# EAGLE design Beechat_Crank_v1.2_B (EAGLE 9.5.2)

## Sheet 1 of 2
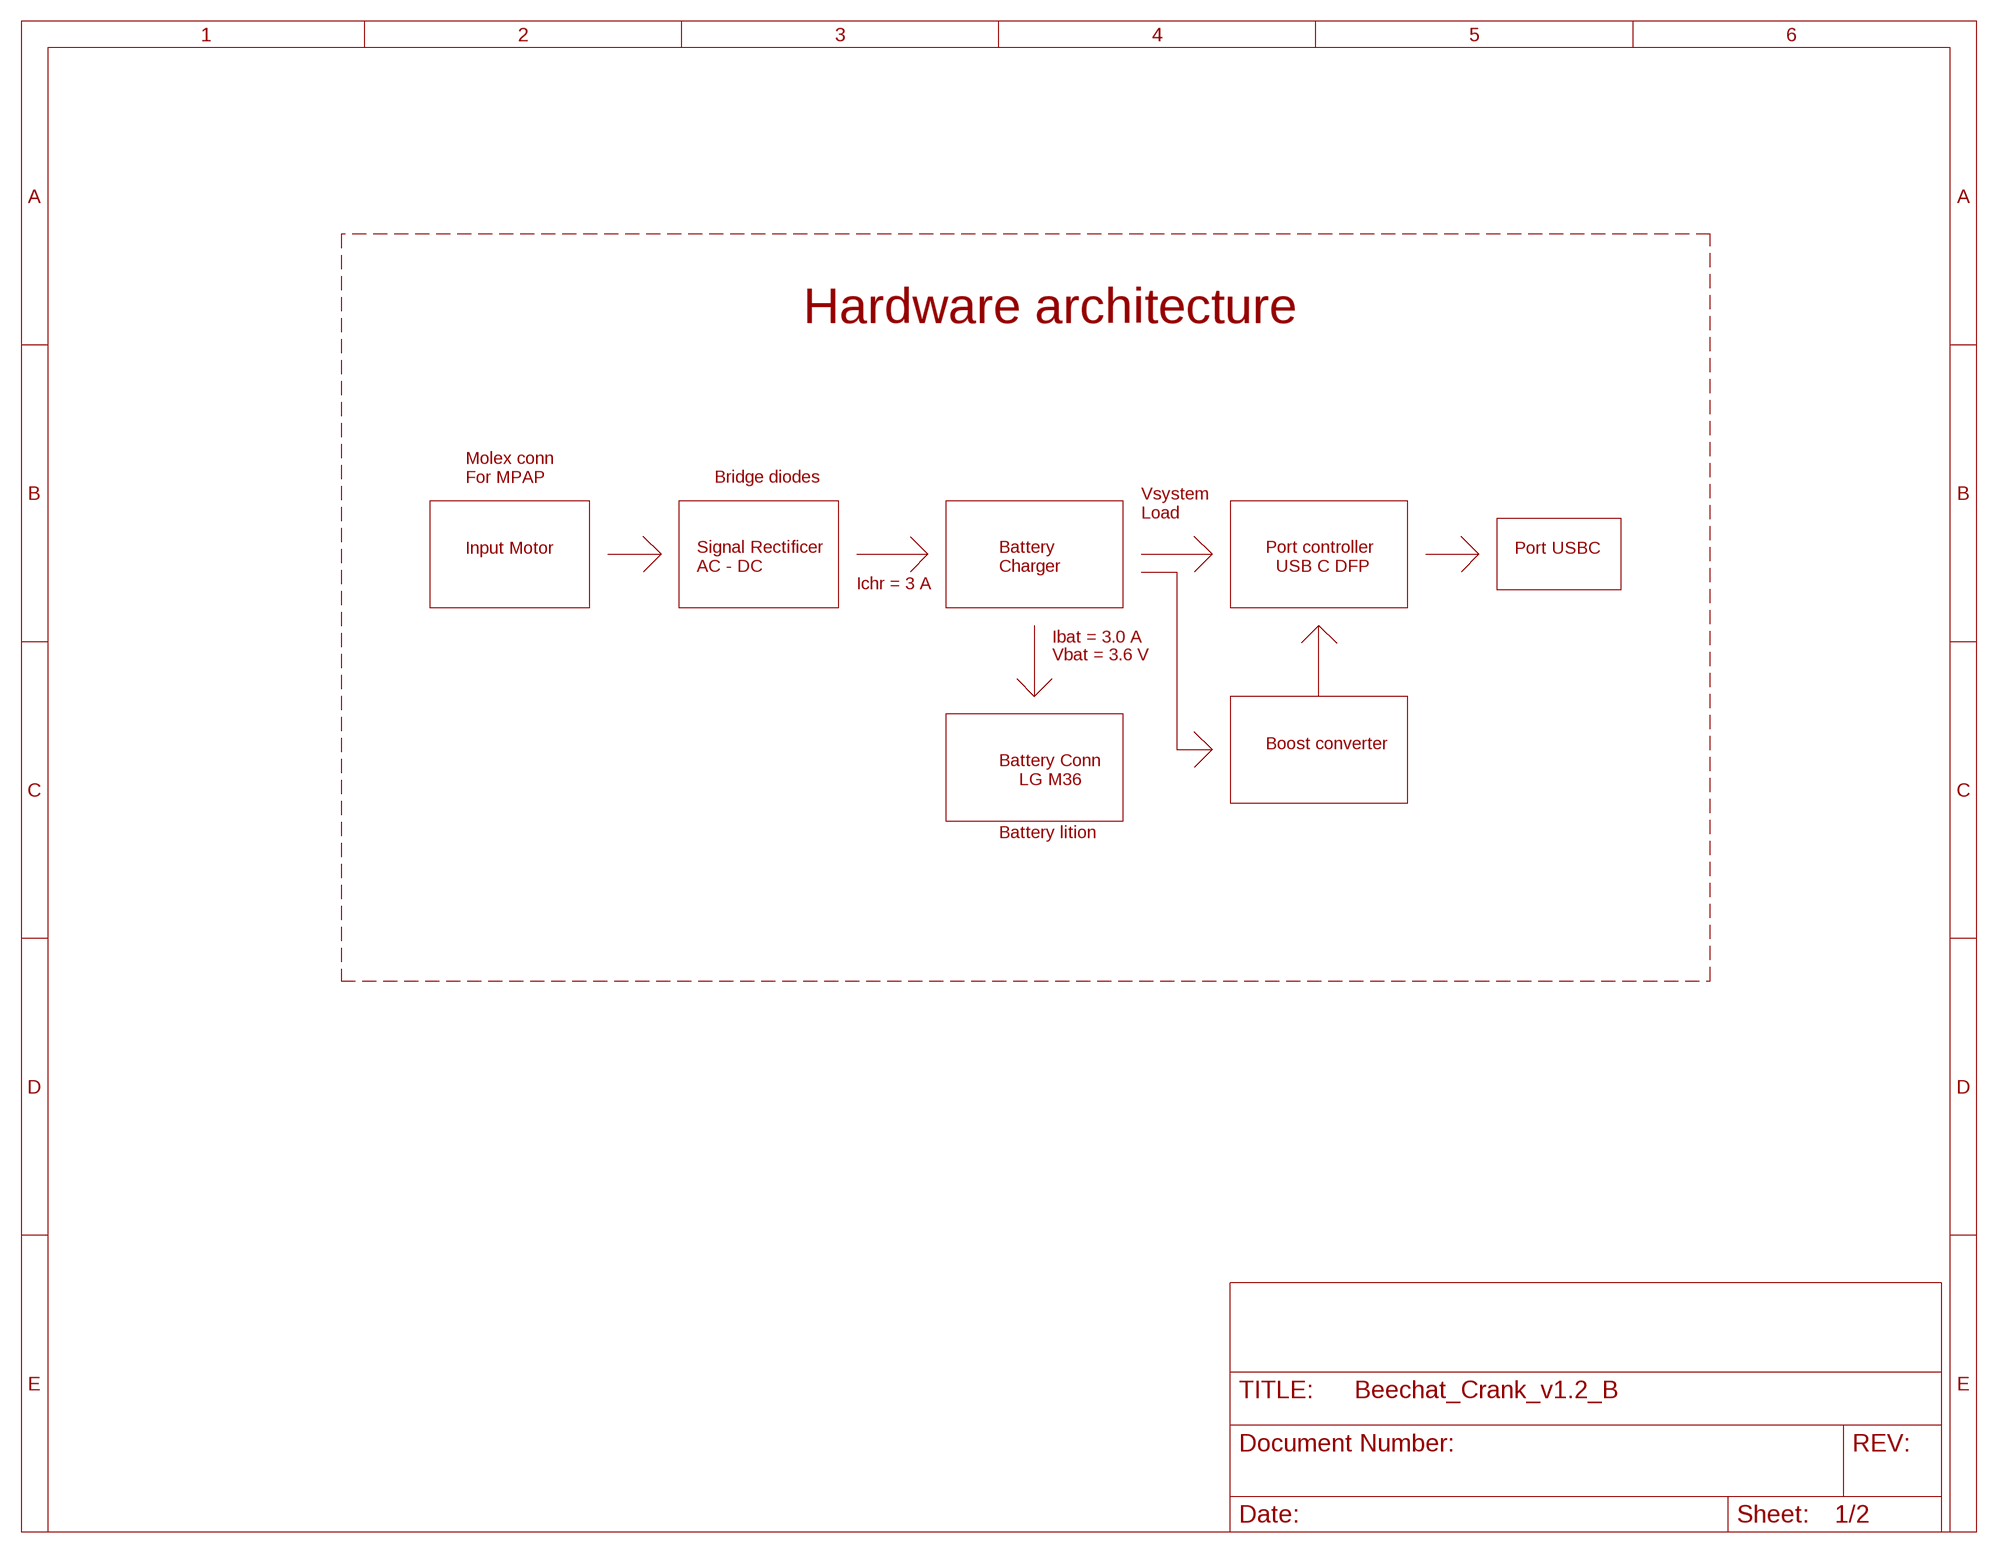
[diagram p0: schematic, sheet 1]

### Notes on the sheet
- Hardware architecture
- Molex conn
  For MPAP
- Bridge diodes
- Vsystem
  Load
- Input Motor | Port USBC
- Signal Rectificer
  AC - DC
- Battery
  Charger
- Port controller
    USB C DFP
- Ichr = 3 A
- Ibat = 3.0 A
- Vbat = 3.6 V
- Boost converter
- Battery Conn
      LG M36
- Battery lition

## Sheet 2 of 2
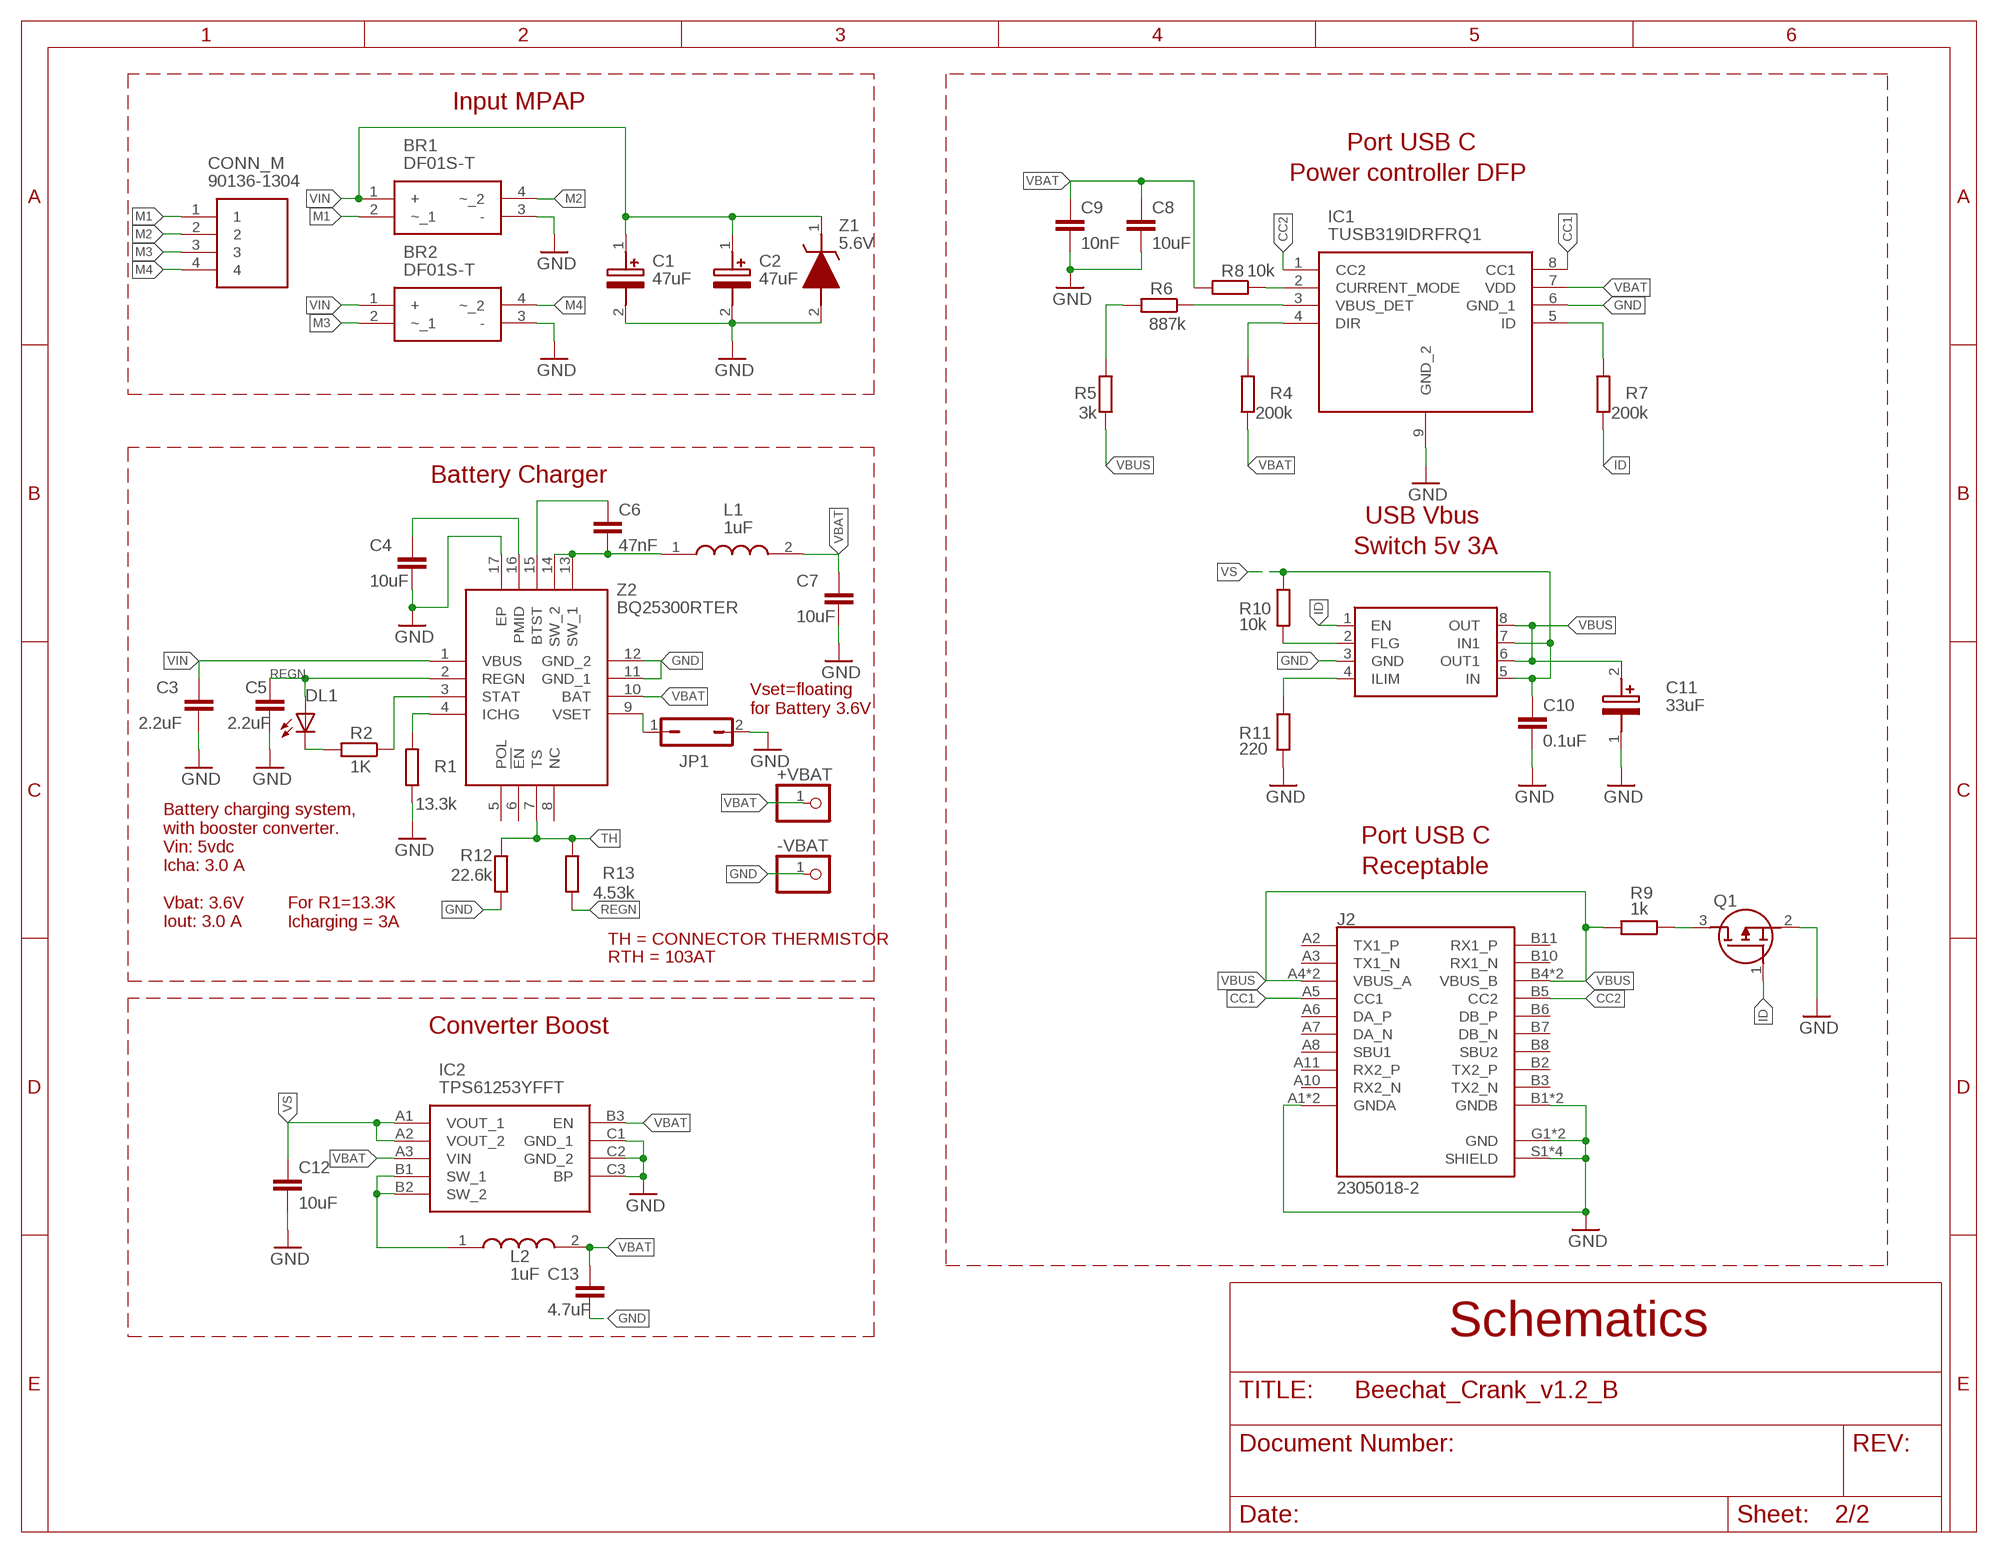
[diagram p1: schematic, sheet 2]

### Parts
+VBAT  PINHD-1X1  [1X01]
-VBAT  PINHD-1X1  [1X01]
BR1  DF01S-T  [SOP510P1040X293-4N]
BR2  DF01S-T  [SOP510P1040X293-4N]
C1  47uF  EEE-HDV470XAP  [CAPAE660X800N]
C2  47uF  EEE-HDV470XAP  [CAPAE660X800N]
C3  2.2uF  C-EUC0603  [C0603]
C4  10uF  C-EUC1210  [C1210]
C5  2.2uF  C-EUC0603  [C0603]
C6  47nF  C-EUC0603  [C0603]
C7  10uF  C-EUC1210  [C1210]
C8  10uF  C-EUC0603  [C0603]
C9  10nF  C-EUC0603  [C0603]
C10  0.1uF  C-EUC0603  [C0603]
C11  33uF  865230343003  [CAPAE660X550N]
C12  10uF  C-EUC0603  [C0603]
C13  4.7uF  C-EUC0603  [C0603]
CONN_M  90136-1304  [SHDR4W65P0X254_1X4_1351X721X11]
DL1  LED_BLUE  LEDSMD0603  [CHIP-LED0603]
IC1  TUSB319IDRFRQ1  [SON50P200X200X80-9N]
IC2  TPS61253YFFT  [BGA9C40P3X3_121X131X62]
J2  2305018-2  [TE_2305018-2]
JP1  JP1Q  [JP1]
L1  1uF  LQH5BPB1R0NT0L  [LQH5BPB100MT0L]
L2  1uF  LQH5BPB1R0NT0L  [LQH5BPB100MT0L]
Q1  SI2337DS-T1-BE3  [SOT95P237X112-3N]
R1  13.3k  R_0603  [R0603]
R2  1K  R_0603  [R0603]
R4  200k  R_0603  [R0603]
R5  3k  R_0603  [R0603]
R6  887k  R_0603  [R0603]
R7  200k  R_0603  [R0603]
R8  10k  R_0603  [R0603]
R9  1k  R_0603  [R0603]
R10  10k  R_0603  [R0603]
R11  220  R_0603  [R0603]
R12  22.6k  R_0603  [R0603]
R13  4.53k  R_0603  [R0603]
U$1  MIC2545  [SOIC127P599X173-8N]
Z1  5.6V  MMSZ5V6T3G  [SOD3716X135N]
Z2  BQ25300RTER  [QFN50P300X300X80-17N]

### Nets
CC1: IC1.8(CC1) J2.A5(CC1)
CC2: IC1.1(CC2) J2.B5(CC2)
GND: -VBAT.1 BR1.3(-) BR2.3(-) C1.2(-) C2.2(-) C3.2 C4.2 C5.2 C7.2 C8.2 C9.2 C10.2 C11.1(-) C12.2 C13.2 IC1.6(GND_1) IC1.9(GND_2) IC2.C1(GND_1) IC2.C2(GND_2) IC2.C3(BP) J2.A1(GNDA) J2.A12(GNDA) J2.B1(GNDB) J2.B12(GNDB) J2.G1(GND) J2.G2(GND) J2.S1(SHIELD) J2.S2(SHIELD) J2.S3(SHIELD) J2.S4(SHIELD) JP1.2 Q1.2(S) R1.1 R11.2 R12.1 U$1.3(GND) Z1.2(A) Z2.11(GND_1) Z2.12(GND_2) Z2.17(EP)
ID: Q1.1(G) R7.1 U$1.1(EN)
M1: BR1.2(~_1) CONN_M.1
M2: BR1.4(~_2) CONN_M.2
M3: BR2.2(~_1) CONN_M.3
M4: BR2.4(~_2) CONN_M.4
N$1: JP1.1 Z2.9(VSET)
N$2: R1.2 Z2.4(ICHG)
N$3: DL1.C R2.2
N$4: C4.1 Z2.16(PMID)
N$5: R2.1 Z2.3(STAT)
N$6: C6.1 Z2.15(BTST)
N$7: C6.2 L1.1 Z2.13(SW_1) Z2.14(SW_2)
N$8: IC1.3(VBUS_DET) R6.1
N$10: R5.2 R6.2
N$11: IC1.4(DIR) R4.2
N$12: IC1.5(ID) R7.2
N$14: R10.2 U$1.2(FLG)
N$15: IC1.2(CURRENT_MODE) R8.1
N$16: IC2.B1(SW_1) IC2.B2(SW_2) L2.1
N$19: Q1.3(D) R9.1
N$20: R11.1 U$1.4(ILIM)
REGN: C5.1 DL1.A R13.1 Z2.2(REGN)
TH: R12.2 R13.2 Z2.7(TS)
VBAT: +VBAT.1 C7.1 C8.1 C9.1 C13.1 IC1.7(VDD) IC2.A3(VIN) IC2.B3(EN) L1.2 L2.2 R4.1 R8.2 Z2.10(BAT)
VBUS: C11.2(+) J2.A4(VBUS_A) J2.A9(VBUS_A) J2.B4(VBUS_B) J2.B9(VBUS_B) R5.1 R9.2 U$1.6(OUT1) U$1.8(OUT)
VIN: BR1.1(+) BR2.1(+) C1.1(+) C2.1(+) C3.1 Z1.1(K) Z2.1(VBUS)
VS: C10.1 C12.1 IC2.A1(VOUT_1) IC2.A2(VOUT_2) R10.1 U$1.5(IN) U$1.7(IN1)
Unconnected: J2.A2(TX1_P) J2.A3(TX1_N) J2.A6(DA_P) J2.A7(DA_N) J2.A8(SBU1) J2.A10(RX2_N) J2.A11(RX2_P) J2.B2(TX2_P) J2.B3(TX2_N) J2.B6(DB_P) J2.B7(DB_N) J2.B8(SBU2) J2.B10(RX1_N) J2.B11(RX1_P) Z2.5(POL) Z2.6(!EN) Z2.8(NC)

### Notes on the sheet
- Input MPAP
- Port USB C
  Power controller DFP
- Battery Charger
- USB Vbus 
  Switch 5v 3A
- Vset=floating 
  for Battery 3.6V
- Port USB C
  Receptable
- Battery charging system, 
  with booster converter.
  Vin: 5vdc
  Icha: 3.0 A
  
  Vbat: 3.6V
  Iout: 3.0 A
- For R1=13.3K
  Icharging = 3A
- TH = CONNECTOR THERMISTOR
- RTH = 103AT
- Converter Boost
- Schematics

## Library data of the parts
+VBAT -VBAT = pinhead:PINHD-1X1: PIN HEADER
BR1 BR2 = Beechat_crank:DF01S-T: 100V 1.0A SURFACE MOUNT GLASS PASSIVATED BRIDGE RECTIFIER Source: Datasheet <https://www.diodes.com/assets/Datasheets/ds17001.pdf>; DESCRIPTION: 100V 1.0A SURFACE MOUNT GLASS PASSIVATED BRIDGE RECTIFIER; HEIGHT: 2.93mm; MANUFACTURER_NAME: Diodes Inc.; MANUFACTURER_PART_NUMBER: DF01S-T; MOUSER_PART_NUMBER: 621-DF01ST; MOUSER_PRICE-STOCK: https://www.mouser.co.uk/ProductDetail/Diodes-Incorporated/DF01S-T?qs=rNZh4F5RthTBu7LNdQlINg%3D%3D
C1 C2 = Beechat_crank:EEE-HDV470XAP: Panasonic 47uF 35V dc Aluminium Electrolytic Capacitor, Surface Mount 6.3 x 7.7mm +105C 6.3mm 7.7mm Source: Datasheet <https://componentsearchengine.com/Datasheets/1/EEE-HDV470XAP.pdf>; DESCRIPTION: Panasonic 47uF 35V dc Aluminium Electrolytic Capacitor, Surface Mount 6.3 x 7.7mm +105C 6.3mm 7.7mm; HEIGHT: 8mm; MANUFACTURER_NAME: Panasonic; MANUFACTURER_PART_NUMBER: EEE-HDV470XAP; MOUSER_PART_NUMBER: 667-EEE-HDV470XAP; MOUSER_PRICE-STOCK: https://www.mouser.com/Search/Refine.aspx?Keyword=667-EEE-HDV470XAP
C3-C10 C12 C13 = rcl:C-EU: CAPACITOR, European symbol; SPICEPREFIX: C
C11 = Beechat_crank:865230343003: Wurth Elektronik Aluminium Electrolytic Capacitor 33uF 16V dc 5.5mm V-Chip WCAP-AS5H Series Aluminium, Surface Mount Source: Datasheet <http://katalog.we-online.com/pbs/datasheet/865230343003.pdf>; DESCRIPTION: Wurth Elektronik Aluminium Electrolytic Capacitor 33uF 16V dc 5.5mm V-Chip WCAP-AS5H Series Aluminium, Surface Mount; HEIGHT: 5.5mm; MANUFACTURER_NAME: Wurth Elektronik; MANUFACTURER_PART_NUMBER: 865230343003; MOUSER_PART_NUMBER: 710-865230343003; MOUSER_PRICE-STOCK: https://www.mouser.co.uk/ProductDetail/Wurth-Elektronik/865230343003?qs=0KOYDY2FL2%2FcWQD%252BNQRRhg%3D%3D
CONN_M = Beechat_crank:90136-1304: Headers & Wire Housings C-Grid Shrd Hdr SR V Hdr SR Vt Au-F 4Ckt Source: Datasheet <https://componentsearchengine.com/Datasheets/2/90136-1304.pdf>; DESCRIPTION: Headers & Wire Housings C-Grid Shrd Hdr SR V Hdr SR Vt Au-F 4Ckt; HEIGHT: 11.1mm; MANUFACTURER_NAME: Molex; MANUFACTURER_PART_NUMBER: 90136-1304; MOUSER_PART_NUMBER: 538-90136-1304; MOUSER_PRICE-STOCK: https://www.mouser.co.uk/ProductDetail/Molex/90136-1304?qs=kEwmkoUtv7Ts48bsv%252BMlhw%3D%3D
DL1 = Beechat_crank:LEDSMD0603: LED_0603
IC1 = Beechat_crank:TUSB319IDRFRQ1: Automotive USB Type-C DFP Port Controller Source: Datasheet <http://www.ti.com/lit/gpn/tusb319-q1>; DESCRIPTION: Automotive USB Type-C DFP Port Controller; HEIGHT: 0.8mm; MANUFACTURER_NAME: Texas Instruments; MANUFACTURER_PART_NUMBER: TUSB319IDRFRQ1; MOUSER_PART_NUMBER: 595-TUSB319IDRFRQ1; MOUSER_PRICE-STOCK: https://www.mouser.co.uk/ProductDetail/Texas-Instruments/TUSB319IDRFRQ1?qs=yBt6ao%2FxsTw8wCSu2pX1OA%3D%3D
IC2 = Beechat_crank:TPS61253YFFT: 3.5MHz, 1500mA peak loading current, high efficiency step-up converter in chip scale packaging Source: Datasheet <http://www.ti.com/lit/ds/symlink/tps61253.pdf>; DESCRIPTION: 3.5MHz, 1500mA peak loading current, high efficiency step-up converter in chip scale packaging; HEIGHT: 0.625mm; MANUFACTURER_NAME: Texas Instruments; MANUFACTURER_PART_NUMBER: TPS61253YFFT; MOUSER_PART_NUMBER: 595-TPS61253YFFT; MOUSER_PRICE-STOCK: https://www.mouser.co.uk/ProductDetail/Texas-Instruments/TPS61253YFFT?qs=5771e39Rz9GCZ%2F3p%2FPQxpQ%3D%3D
J2 = Beechat_crank:2305018-2: TYPE C Right Angle Sealable SMT IPX8 3.1 GEN 2 Wire to Board USB Check prices <https://pricing.snapeda.com/parts/2305018-2/TE%20Connectivity/view-part?ref=eda>; AVAILABILITY: In Stock; COMMENT: 2305018-2; DESCRIPTION: USB TYPE C, REC IPX8 ON BOARD DUAL SMT; MF: TE Connectivity; MP: 2305018-2; PACKAGE: None; PRICE: None; PURCHASE-URL: https://pricing.snapeda.com/search/part/2305018-2/?ref=eda
JP1 = jumper:JP1Q: JUMPER
L1 L2 = Beechat_crank:LQH5BPB1R0NT0L: LQH5BPB_T0 Series Inductor 1.0uH +/-30% 2020 (5050) Source: Datasheet <https://psearch.en.murata.com/inductor/product/LQH5BPB1R0NT0#.html>; DESCRIPTION: LQH5BPB_T0 Series Inductor 1.0uH +/-30% 2020 (5050); HEIGHT: 2.2mm; MANUFACTURER_NAME: Murata Electronics; MANUFACTURER_PART_NUMBER: LQH5BPB1R0NT0L; MOUSER_PART_NUMBER: 81-LQH5BPB1R0NT0L; MOUSER_PRICE-STOCK: https://www.mouser.co.uk/ProductDetail/Murata-Electronics/LQH5BPB1R0NT0L?qs=hNud%2FORuBR2f37IsVc4FxA%3D%3D
Q1 = Beechat_crank:SI2337DS-T1-BE3: MOSFET P-CHANNEL 80-V (D-S) Source: Datasheet <https://www.vishay.com/docs/73533/si2337ds.pdf>; DESCRIPTION: MOSFET P-CHANNEL 80-V (D-S); HEIGHT: 1.12mm; MANUFACTURER_NAME: Vishay; MANUFACTURER_PART_NUMBER: SI2337DS-T1-BE3; MOUSER_PART_NUMBER: 78-SI2337DS-T1-BE3; MOUSER_PRICE-STOCK: https://www.mouser.co.uk/ProductDetail/Vishay-Siliconix/SI2337DS-T1-BE3?qs=CiayqK2gdcKwfz5JxPKQMQ%3D%3D
R1 R2 R4-R13 = Beechat_crank:R_0603: R_0603
U$1 = Beechat_crank:MIC2545: MIC2545 POWER SWICTH
Z1 = Beechat_crank:MMSZ5V6T3G: ON Semiconductor MMSZ5V6T3G Zener Diode, 5.6V 5% 0.5 W SMT 2-Pin SOD-123 Source: Datasheet <https://componentsearchengine.com/Datasheets/1/MMSZ5V6T3G.pdf>; DESCRIPTION: ON Semiconductor MMSZ5V6T3G Zener Diode, 5.6V 5% 0.5 W SMT 2-Pin SOD-123; HEIGHT: 1.35mm; MANUFACTURER_NAME: ON Semiconductor; MANUFACTURER_PART_NUMBER: MMSZ5V6T3G; MOUSER_PART_NUMBER: 863-MMSZ5V6T3G; MOUSER_PRICE-STOCK: https://www.mouser.com/Search/Refine.aspx?Keyword=863-MMSZ5V6T3G
Z2 = Beechat_crank:BQ25300RTER: Battery Management Standalone 1-cell, 17-V, 3.0-A battery charger 16-WQFN -40 to 85 Source: Datasheet <https://www.ti.com/lit/ds/symlink/bq25300.pdf?ts=1623424163690&ref_url=https%3A%2F%2Fwww.ti.com%2Fstore%2Fti%2Fen%2Fp%2Fproduct%2F%3Fp%3DBQ25300RTER>; DESCRIPTION: Battery Management Standalone 1-cell, 17-V, 3.0-A battery charger 16-WQFN -40 to 85; HEIGHT: 0.8mm; MANUFACTURER_NAME: Texas Instruments; MANUFACTURER_PART_NUMBER: BQ25300RTER; MOUSER_PART_NUMBER: 595-BQ25300RTER; MOUSER_PRICE-STOCK: https://www.mouser.co.uk/ProductDetail/Texas-Instruments/BQ25300RTER?qs=iLbezkQI%252Bsg3JAZ7PkUvYA%3D%3D

## Board
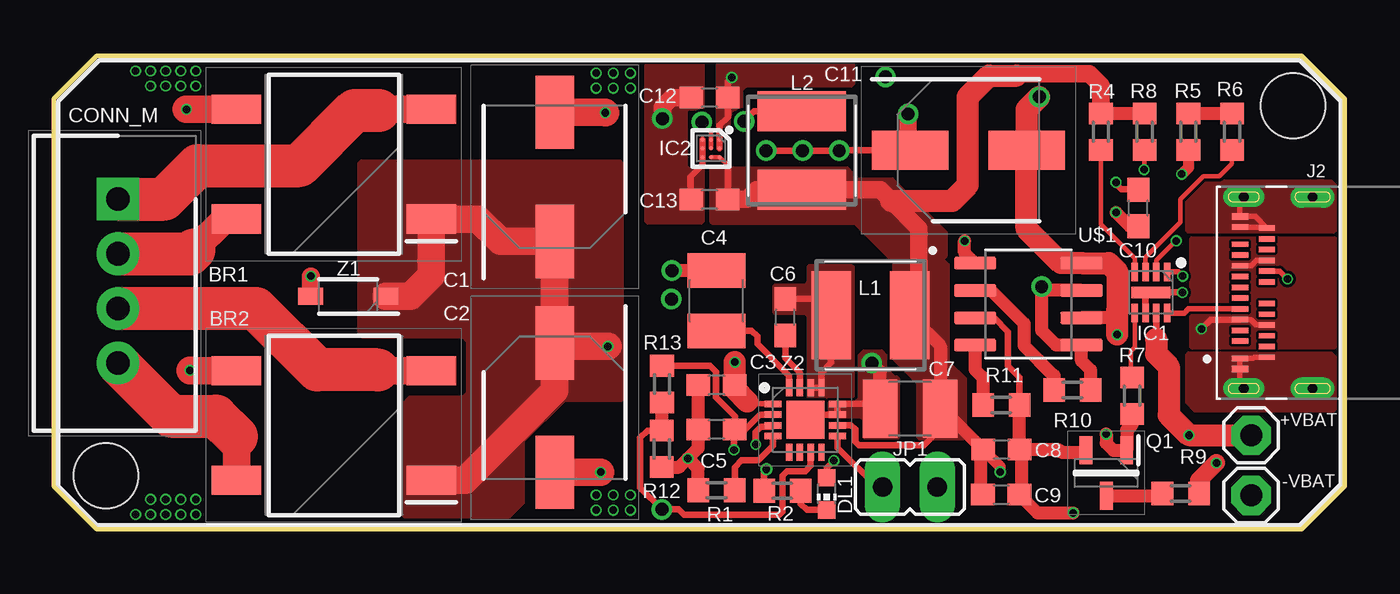
[diagram p2: board, top side]
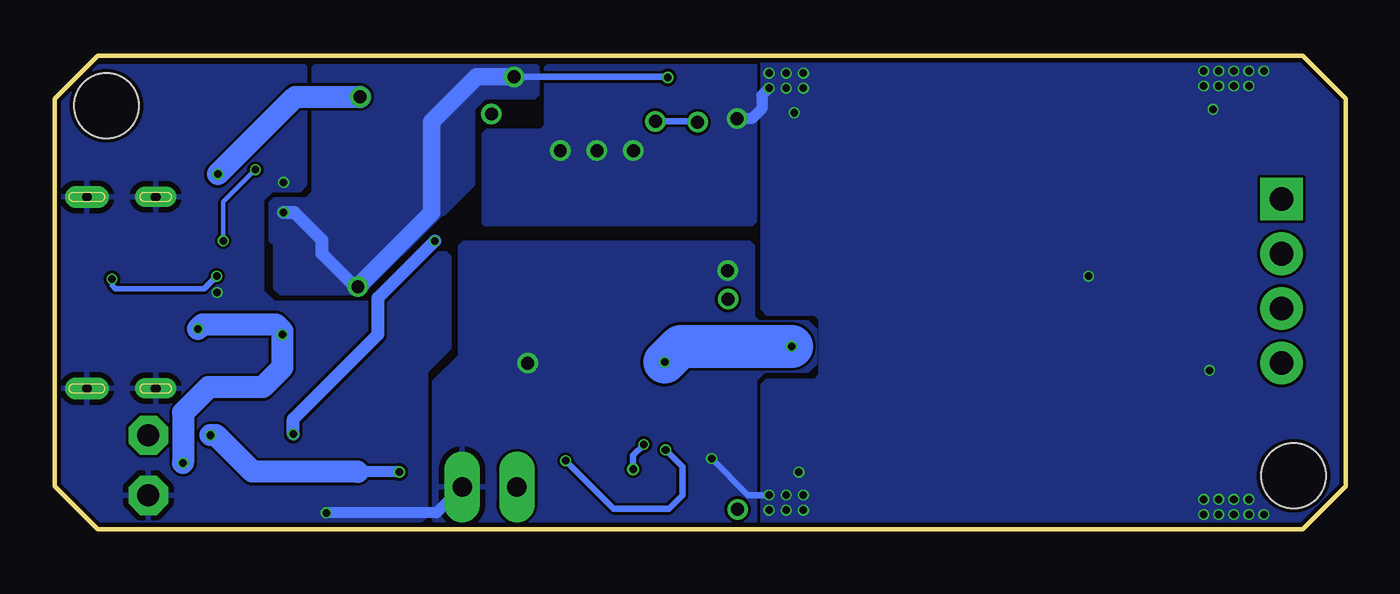
[diagram p3: board, bottom side, seen from below]

Size 60 x 22 mm. Coordinates in mm from the lower left corner, seen from the top.
Outline: 2,0 58,0 60,2 60,20 58,22 2,22 0,20 0,2 2,0
Copper layers (1*16): Top 0.035mm / dielectric 1.6mm / Bottom 0.035mm
Design rules "jlcpcb-2layers": minimum track width 5mil, minimum drill 0.3mm, track to track 5mil, track to pad 5mil, pad to pad 5mil, via to via 5mil, smd to smd 5mil, copper to edge 0.2mm, drill to drill 6mil, minimum pad ring 10mil, minimum via ring 3mil, stop-mask expansion 4mil, vias tented up to drill 0mil, thermal gap 10mil
Holes 3 mm at 2.42,2.5 57.59,19.68

### Footprints (pad centres in the part's own frame; a part is rotated, then mirrored left to right if it is on the bottom)
1X01 = drill 1.016 octagon: 1 0,0
SOP510P1040X293-4N = smd 2.3 x 1.35: 1 -4.525,2.55; 2 -4.525,-2.55; 3 4.525,-2.55; 4 4.525,2.55
CAPAE660X800N = smd 3.4 x 1.8: 1 -3,0; 2 3,0
C0603 = smd 1.1 x 1: 1 -0.85,0; 2 0.85,0
C1210 = smd 1.6 x 2.7: 1 -1.4,0; 2 1.4,0
CAPAE660X550N = smd 3.55 x 1.8: 1 -2.7,0; 2 2.7,0
SHDR4W65P0X254_1X4_1351X721X11 = drill 1.1 pad 1.65 square: 1 0,0 | drill 1.1 pad 1.65: 2 -2.54,0; 3 -5.08,0; 4 -7.62,0
CHIP-LED0603 = smd 0.8 x 0.8: A 0,-0.75; C 0,0.75
SON50P200X200X80-9N = smd 0.85 x 0.3: 1 -0.95,0.75; 2 -0.95,0.25; 3 -0.95,-0.25; 4 -0.95,-0.75; 5 0.95,-0.75; 6 0.95,-0.25; 7 0.95,0.25; 8 0.95,0.75 | smd 0.525 x 1.825: 9 0,0
BGA9C40P3X3_121X131X62 = smd 0.2 x 0.2: A1 -0.4,0.4; A2 0,0.4; A3 0.4,0.4; B1 -0.4,0; B2 0,0; B3 0.4,0; C1 -0.4,-0.4; C2 0,-0.4; C3 0.4,-0.4
TE_2305018-2 = smd 0.25 x 0.75: A1 -3.05,3.375; A2 -2.25,3.375; A3 -1.75,3.375; A4 -1.25,3.375; A5 -0.75,3.375; A6 -0.25,3.375; A7 0.25,3.375; A8 0.75,3.375; A9 1.25,3.375; A10 1.75,3.375; A11 2.25,3.375; A12 3.05,3.375; B1 3,2.125; B2 2.5,2.125; B3 2,2.125; B4 1.5,2.125; B5 1,2.125; B6 0.5,2.125; B7 -0.5,2.125; B8 -1,2.125; B9 -1.5,2.125; B10 -2,2.125; B11 -2.5,2.125; B12 -3,2.125 | smd 0.3 x 0.75: G1 -3.55,3.375; G2 3.55,3.375 | drill 0.45 pad 1.025 long: S1 -4.45,0; S2 4.45,0 | drill 0.45 pad 0.925 long: S3 -4.45,3.2; S4 4.45,3.2
JP1 = drill 0.914 long: 1 0,-1.27; 2 0,1.27
LQH5BPB100MT0L = smd 1.85 x 4.1: 1 -1.825,0; 2 1.825,0
SOT95P237X112-3N = smd 1.3 x 0.6: 1 -1.05,0.95; 2 -1.05,-0.95; 3 1.05,0
R0603 = smd 1 x 1.1: 1 -0.85,0; 2 0.85,0
SOIC127P599X173-8N = smd 1.98 x 0.59: 1 -2.47,1.905; 2 -2.47,0.635; 3 -2.47,-0.635; 4 -2.47,-1.905; 5 2.47,-1.905; 6 2.47,-0.635; 7 2.47,0.635; 8 2.47,1.905
SOD3716X135N = smd 1.15 x 0.8: 1 -1.75,0; 2 1.75,0
QFN50P300X300X80-17N = smd 0.8 x 0.3: 1 -1.5,0.75; 2 -1.5,0.25; 3 -1.5,-0.25; 4 -1.5,-0.75; 9 1.5,-0.75; 10 1.5,-0.25; 11 1.5,0.25; 12 1.5,0.75 | smd 0.3 x 0.8: 5 -0.75,-1.5; 6 -0.25,-1.5; 7 0.25,-1.5; 8 0.75,-1.5; 13 0.75,1.5; 14 0.25,1.5; 15 -0.25,1.5; 16 -0.75,1.5 | smd 1.76 x 1.76: 17 0,0

### Placement (x,y rotation side)
+VBAT  55.64,4.38 0 top
-VBAT  55.64,1.59 0 top
BR1  13.01,16.97 180 top
BR2  13.01,4.83 180 top
C1  23.28,16.38 90 top
C2  23.28,5.66 270 top
C3  30.8,6.71 180 top
C4  30.79,10.63 90 top
C5  30.8,4.65 180 top
C6  34,9.86 90 top
C7  39.8,5.61 180 top
C8  44.03,3.72 0 top
C9  44.03,1.62 0 top
C10  50.4,14.94 90 top
C11  42.5,17.62 0 top
C12  30.47,20.06 180 top
C13  30.47,15.33 180 top
CONN_M  2.98,15.35 90 top
DL1  35.92,1.66 180 top
IC1  50.98,11.01 270 top
IC2  30.54,17.7 270 top
J2  58.5,11 90 top
JP1  39.78,1.97 270 top
L1  37.95,9.95 0 top
L2  34.76,17.6 270 top
Q1  48.91,2.63 270 top
R1  30.8,1.82 0 top
R2  33.86,1.8 0 top
R4  48.66,18.47 270 top
R5  52.72,18.47 90 top
R6  54.75,18.47 90 top
R7  50.11,6.21 90 top
R8  50.69,18.47 90 top
R9  52.37,1.67 0 top
R10  47.33,6.48 180 top
R11  44.03,5.78 0 top
R12  28.26,3.74 90 top
R13  28.26,6.76 270 top
U$1  45.29,10.47 0 top
Z1  13.69,10.83 180 top
Z2  34.92,5.09 0 top

### Tracks (layer width: path | path; a pad name or v marks a point on that pad's centre or on a via)
CC1
  Top 0.254: J2.A5 52.73,10.25 52.53,10.06 51.87,10.06 IC1.8
CC2  (via drill 0.35)
  Top 0.254: J2.B5 56.97,12 v57.33,11.63 | v52.46,11.77 v52.45,11.77 52.26,11.96 IC1.1
  Bottom 0.254: v57.33,11.63 57.33,11.34 57.18,11.18 53.05,11.18 v52.46,11.77
GND  (via drill 0.35, 0.6 pad 0.95)
  Top 0.254: J2.B12 55.78,8 55.73,7.95 J2.A1 J2.G1 55.12,6.72 J2.S3 | J2.A12 56.33,14.05 J2.B1 55.83,14.55 J2.G2 55.12,15.28 J2.S4
  Top 0.305: C7.2 38.16,5.84 Z2.12 Z2.11 35.17,5.34 Z2.17 | IC2.C1 IC2.C2 IC2.C3 30.14,16.94 29.6,16.39 29.6,15.36 C13.2 | C10.2 50.39,15.8 49.61,15.8 49.36,16.05 v49.36,16.13 | U$1.3 43.7,9.83 44.34,9.19 44.34,7.61 44.88,7.06 R11.2 | IC1.6 50.73,10.76 IC1.9 v52.45,11.01 | v52.45,11.01 | C11.1 36.52,17.62 v36.5,17.6 v34.8,17.6 v33.1,17.6
  Top 0.61: C4.2 v28.73,12.03 v28.73,12.02 | C3.2 C5.2 29.95,3.77 v29.47,3.3 | R12.1 29.07,2.89 v29.47,3.3 | R1.1 29.95,2.83 v29.47,3.3 | C7.2 38.4,7.35 v38.01,7.73 | C8.2 44.96,3.64 44.96,1.71 C9.2 45.72,0.78 v47.38,0.78 | C8.2 R11.2 | C8.2 46.68,3.72 46.8,3.6 47.88,3.6 Q1.2
  Top 0.813: Z1.2 11.94,11.76 v11.95,11.77 | C11.1 39.7,17.72 v39.7,19.3 | C12.2 28.7,20.06 28.29,19.65 v28.29,19.09
  Top 1.27: C2.2 v25.41,2.66 | v25.41,2.66 | C1.2 25.61,19.38 v25.63,19.36 | BR1.3 v6.16,19.52 | BR2.3 v6.34,7.38 v6.33,7.39
  Bottom 0.305: v29.47,3.3 27.77,1.6 v26.8,1.6
  Bottom 0.508: v26.8,20.5 27.14,20.16 27.14,19.54 27.59,19.09 v28.29,19.09 | JP1.2 42.25,0.78 v47.38,0.78
  other vias: 3.8,21.3 4.5,21.3 5.2,21.3 5.9,21.3 6.6,21.3 4.5,20.6 5.2,20.6 5.9,20.6 6.6,20.6 3.8,0.7 4.5,0.7 5.2,0.7 5.9,0.7 6.6,0.7 4.5,1.4 5.2,1.4 5.9,1.4 6.6,1.4 25.2,1.6 26,1.6 25.2,0.9 26,0.9 26.8,0.9 25.2,21.2 26,21.2 26.8,21.2 25.2,20.5 26,20.5
  pour Bottom (no thermals): 0.15,19.96 0.15,2.07 2.04,0.18 27,0.18 27.17,0.35 27.17,6.75 26.91,7.01 24.66,7.01 24.47,7.2 24.47,9.75 24.66,9.94 26.9,9.94 27.18,10.22 27.18,21.69 27.04,21.83 2.02,21.83
  pour Bottom: 27.4,0.3 42.3,0.3 42.4,0.4 42.4,6.9 41.2,8.1 41.2,13.2 41,13.4 27.7,13.4 27.5,13.2 27.5,9.9 27.3,9.7 25,9.7 24.6,9.3 24.6,7.7 25,7.3 27,7.3 27.4,6.9
  pour Top (no thermals): 36,5.22 37.48,5.22 37.6,5.1 37.6,4.3 37.7,4.2 39.2,4.2 39.3,4.3 39.3,7 39.2,7.1 39.1,7.1 38.7,7.5 38.7,8.1 38.5,8.3 37.6,8.3 37.4,8.1 37.4,6.1 37.2,5.9 36,5.9
  pour Top (no thermals): 30.2,16.8 30.2,14.3 30.1,14.2 27.6,14.2 27.5,14.3 27.5,21.6 30.2,21.6 30.2,19.6 30.1,19.5 29.5,19.5 29.4,19.4 29.4,16.9 29.5,16.8
  pour Bottom (no thermals): 27.4,21.6 27.4,14.3 27.6,14.1 40,14.1 40.1,14.2 40.1,18.4 39.9,18.6 37.4,18.6 37.2,18.8 37.2,21.5 37.1,21.6
  pour Bottom: 41.6,12.7 41.6,8.4 42.7,7.3 42.7,0.6 43.1,0.2 57.8,0.2 59.8,2.2 59.8,19.9 58.1,21.6 48.4,21.6 48.3,21.5 48.3,16 48.6,15.7 49.9,15.7 50.3,15.3 50.3,11.1 49.8,10.6 44.5,10.6 42.2,12.9 41.8,12.9
  pour Top (no thermals): 52.6,8.1 52.6,5.9 53,5.5 59.5,5.5 59.6,5.6 59.6,8 59.4,8.2 52.7,8.2
  pour Top (no thermals): 52.6,15.2 52.6,13.9 52.7,13.8 59.5,13.8 59.6,13.9 59.6,16 59.4,16.2 53.6,16.2
ID  (via drill 0.35)
  Top 0.61: U$1.1 42.33,12.86 v42.33,13.4 | R7.1 50.11,4.87 49.86,4.61 Q1.1 49.24,3.68 48.91,4.01 v48.91,4.43
  Bottom 0.61: v42.33,13.4 44.99,10.74 44.99,9.05 48.91,5.12 v48.91,4.43
M1
  Top 1.27: 15.1,19.47 15.15,19.52 BR1.2
  Top 2: CONN_M.1 5.14,15.35 6.69,16.9 11.42,16.9 13.99,19.47 15.1,19.47
M2
  Top 1.27: 6.51,12.99 7.92,14.4 8.49,14.4 BR1.4
  Top 2: CONN_M.2 6.33,12.81 6.51,12.99
M3
  Top 1.27: BR2.2 15.08,7.38 15.05,7.41
  Top 2: CONN_M.3 9.39,10.27 12.25,7.41 15.05,7.41
M4
  Top 1.27: 8.48,4.32 8.49,4.31 BR2.4
  Top 2: CONN_M.4 5.44,5.27 7.53,5.27 8.48,4.32
N$1
  Top 0.305: Z2.9 36.42,3.81 38.26,1.97 JP1.1
N$2
  Top 0.305: Z2.4 33.42,3.9 32.75,3.22 31.97,3.22 31.64,2.9 R1.2
N$3
  Top 0.305: R2.2 34.71,1.19 34.99,0.91 DL1.C
N$4
  Top 0.305: Z2.16 34.17,7.15 32.69,8.63 32.69,8.97 32.43,9.23 C4.1
N$5  (via drill 0.35, 0.35 pad 0.55)
  Top 0.305: Z2.3 33.36,4.77 32.87,4.77 32.62,4.53 v32.62,3.94 | R2.1 33.01,2.69 v33.12,2.8
  Bottom 0.305: v33.12,2.8 33.12,3.45 v32.62,3.94
N$6
  Top 0.305: Z2.15 34.67,7.29 34,7.96 C6.1
N$7
  Top 0.305: Z2.14 Z2.13 35.67,7.29 36.12,7.74 L1.1 36.12,10.63 36.05,10.71 C6.2
  pour Top (no thermals): 35,6.1 37.1,6.1 37.2,6.2 37.2,12.2 37.1,12.3 35.1,12.3 35,12.2 35,11.5 34.9,11.4 33.5,11.4 33.4,11.3 33.4,10.1 33.5,10 34.9,10 35,9.9
N$8
  Top 0.203: IC1.3 50.73,12.65 52.35,14.27 52.35,15.33 53.42,16.41 54.17,16.41 54.75,16.99 R6.1
N$9  (via drill 0.6 pad 0.95)
  other vias: 28.7,10.7
N$10
  Top 0.61: R5.2 R6.2
N$11
  Top 0.203: IC1.4 50.23,12.6 48.66,14.17 R4.2
N$12
  Top 0.203: IC1.5 50.23,8.47 50.05,8.29 50.05,7.12 R7.2
N$14
  Top 0.61: U$1.2 43.55,11.1 45.09,9.57 45.09,8.55 46.48,7.15 R10.2
N$15  (via drill 0.35)
  Top 0.203: IC1.2 51.23,12.51 52.13,13.41 v52.16,13.41 | v50.67,16.71 50.67,17.6 R8.1
  Bottom 0.203: v52.16,13.41 52.16,15.22 v50.67,16.71
N$16  (via drill 0.6 pad 0.95)
  Top 0.2: IC2.B2 IC2.B1 30.54,18.49 v30.11,18.92
  Top 0.305: v32.08,18.96 32.55,19.43 L2.1
  Bottom 0.305: v30.11,18.92 30.15,18.96 v32.08,18.96
N$19
  Top 0.61: Q1.3 51.43,1.58 R9.1
N$20
  Top 0.61: U$1.4 42.82,7.42 43.18,7.06 R11.1
REGN  (via drill 0.35)
  Top 0.305: Z2.2 32.82,5.34 32.13,4.65 C5.1 | DL1.A 35.92,2.87 v36.25,3.2 | v31.61,3.7 31.61,4.61 C5.1 | R13.1 30.5,7.61 30.77,7.33 30.77,6.14 31.64,5.27 C5.1
  Bottom 0.305: v36.25,3.2 34.02,0.97 31.44,0.97 30.82,1.59 30.82,2.91 v31.61,3.7
TH  (via drill 0.6 pad 0.95)
  Top 0.305: Z2.7 35.17,2.96 34.93,2.72 34.08,2.72 33.87,2.51 33.87,0.83 33.73,0.69 29.28,0.69 29.03,0.94 v28.27,0.94 v28.26,0.93 27.25,1.94 27.25,4.25 27.59,4.59 R12.2
  Top 0.61: R12.2 R13.2
VBAT  (via drill 0.35, 0.35 pad 0.55)
  Top 0.2: IC2.B3 IC2.A3 31.32,16.92
  Top 0.305: Z2.10 37.06,4.84 37.25,4.65 37.25,4.07 37.41,3.91 40.44,3.91 41.2,4.67 41.2,5.45 C7.1 | 31.32,16.92 C13.1 | IC1.7 51.23,8.85
  Top 0.508: C8.1 43.98,2.93 v43.98,2.67
  Top 0.61: R4.1 R8.2 | L1.2 40,9.73 41.2,8.53 41.2,5.45 41.45,5.45 C8.1 43.07,3.61 43.07,1.73 C9.1
  Top 0.813: 40,9.73 40.21,9.94 40.21,13.98 38.92,15.27 38.41,15.78 L2.2 32.66,15.78 32.21,15.33 C13.1 | 44.75,21.08 44.85,21.17 48.11,21.17 48.66,20.63 R4.1
  Top 1.016: 51.23,8.85 51.23,8.16 51.82,7.58 51.82,5.31 v52.75,4.38 +VBAT.1 | 38.92,15.27 41.76,15.27 42.48,15.99 42.48,20.1 43.46,21.08 44.75,21.08
  Bottom 0.508: v43.98,2.67 45.91,2.67 45.91,2.68
  Bottom 1.016: 45.91,2.68 45.92,2.69 50.8,2.69 52.49,4.38 v52.75,4.38
  pour Top (no thermals): 40.2,4.2 42.3,4.2 42.4,4.3 42.4,7 41.6,7.8 41.6,12.3 41.4,12.5 39,12.5 39,7.9 40.1,6.8 40.1,4.3
  pour Top (no thermals): 30.5,16.8 30.5,14.3 30.6,14.2 34,14.2 37.2,14.2 38.8,12.6 41.4,12.6 41.5,12.7 41.5,13.8 39.1,16.2 39,16.3 37.2,16.3 37.1,16.4 37.1,16.6 36.9,16.8
VBUS  (via drill 0.35, 0.6 pad 0.95)
  Top 0.254: J2.A4 55.62,9.75 55.87,9.5 J2.B9 | J2.A9 55.64,12.25 55.89,12.5 J2.B4
  Top 0.305: v53.33,9.32 53.76,9.75 J2.A4
  Top 0.508: R5.1 52.72,16.81 v52.41,16.5
  Top 0.61: U$1.6 49.07,9.83 49.4,10.16 49.42,10.18 | 49.4,9.07 v49.42,9.05
  Top 0.813: v54.03,3.09 53.22,2.28 R9.2
  Top 1.016: 49.42,10.18 49.42,11.97 49.02,12.37 U$1.8 46.8,12.37 45.2,13.97 C11.2 45.2,19.5 v45.8,20.1 | 49.4,10.16 49.4,9.07
  Bottom 0.61: v49.42,9.05 49.42,9.23
  Bottom 1.016: v52.41,16.5 48.82,20.1 v45.8,20.1 | 49.42,9.23 49.72,9.53 53.12,9.53 v53.33,9.32 | v49.42,9.05 49.42,7.52 50.33,6.61 52.85,6.61 54.03,5.43 v54.03,3.09
  pour Top (no thermals): 52.8,13.5 52.8,8.5 52.87,8.43 59.53,8.43 59.6,8.5 59.6,13.5 59.54,13.56 52.86,13.56
VIN  (via drill 0.35)
  Top 0.254: 32.22,5.94 32.32,5.84 Z2.1
  Top 1.016: v31.65,7.77 v31.64,7.76 C3.1 31.64,6.51 32.22,5.94
  Top 1.27: C2.1 C1.1 20.77,13.38 19.73,14.42 BR1.1 17.54,11.8 16.57,10.83 Z1.1 | BR2.1 19.11,2.28 23.28,6.45 C2.1 | v25.75,8.51 23.43,8.51 C2.1
  Bottom 2: v31.65,7.77 30.91,8.51 v25.75,8.51
  pour Top (no thermals): 16.18,5.85 16.18,0.63 16.27,0.54 21.18,0.54 21.88,1.24 21.88,4.09 23.75,5.96 26.41,5.96 26.48,6.03 26.48,17.01 26.34,17.15 14.25,17.15 14.11,17.01 14.11,9.1 14.3,8.91 18.99,8.91 19.17,8.73 19.17,6.36 18.99,6.18 16.51,6.18
VS  (via drill 0.35, 0.35 pad 0.55, 0.6 pad 0.95)
  Top 0.305: IC2.A2 IC2.A1 30.94,18.77 31.32,19.15 C12.1 31.32,20.81 v31.5,21
  Top 0.61: U$1.7 46.09,11.1 v45.91,11.29 45.91,9.24 46.58,8.56 U$1.5 47.76,7.83 48.18,7.4 R10.1 | v38.65,21.02 38.58,21.09 | C10.1 50.01,14.09 v49.36,14.74
  Bottom 0.305: v38.65,21.02 31.53,21.02 v31.5,21
  Bottom 0.61: v49.36,14.74 48.86,14.74 47.58,13.45 47.58,12.83 46.03,11.29 v45.91,11.29
  Bottom 0.813: v45.91,11.29 42.48,14.72 42.48,18.93 40.38,21.02 v38.65,21.02
  pour Top (no thermals): 30.8,18.7 31.3,18.7 31.5,18.9 31.5,19.4 31.6,19.5 31.9,19.5 32,19.6 32,20.4 32.2,20.6 37.1,20.6 37.2,20.7 37.2,21.6 30.8,21.6
  pour Bottom (no thermals): 37.5,21.5 37.5,20.2 37.7,20 40,20 40.5,19.5 40.5,16 41.9,14.6 42,14.6 45.7,10.9 46.3,10.9 49.5,10.9 49.7,11.1 49.8,11.2 49.8,13.2 50,13.4 50,15 50,15.2 49.8,15.4 48.3,15.4 48.2,15.5 48,15.7 48,17.9 48,21.5 47.9,21.6 37.6,21.6